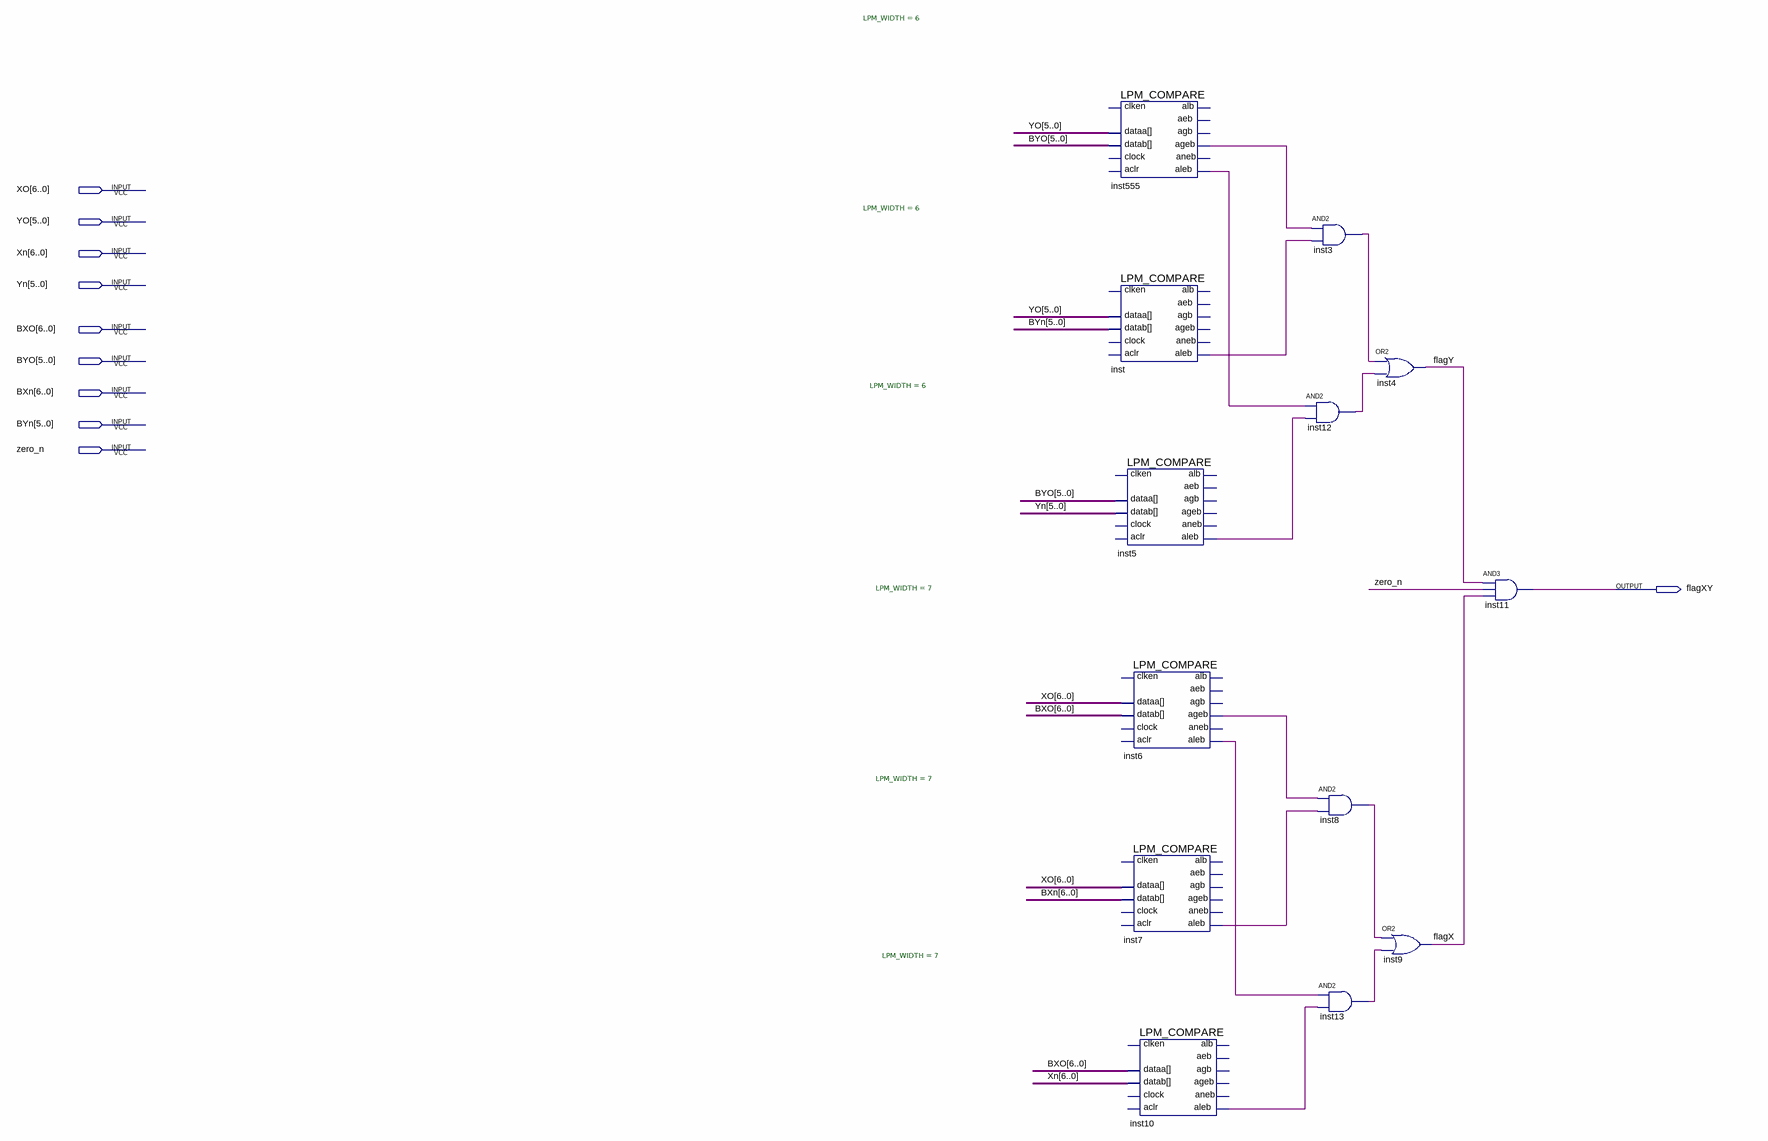
[diagram p0: schematic sheet]
// Quartus schematic HTPA_FIND_JUNCTION.bdf as structural Verilog: 13 symbols, 10 pins
module HTPA_FIND_JUNCTION (
  input  [6:0] XO,
  input  [5:0] YO,
  input  [6:0] Xn,
  input  [5:0] Yn,
  input  [6:0] BXO,
  input  [5:0] BYO,
  input  [6:0] BXn,
  input  [5:0] BYn,
  input  zero_n,
  output flagXY
);

  wire flagX, flagY, inst3_out, inst5_aleb, inst6_ageb, inst6_aleb, inst7_aleb, inst8_out, inst10_aleb,
       inst12_out, inst13_out, inst555_ageb, inst555_aleb, inst_aleb;

  LPM_COMPARE #(.LPM_WIDTH(6)) inst555 (
    .dataa(YO), .datab(BYO), .aleb(inst555_aleb), .ageb(inst555_ageb));  // open: clock, aclr, clken, aeb, agb, aneb, alb
  LPM_COMPARE #(.LPM_WIDTH(6)) inst (
    .dataa(YO), .datab(BYn), .aleb(inst_aleb));  // open: clock, aclr, clken, aeb, agb, aneb, ageb, alb
  LPM_COMPARE #(.LPM_WIDTH(6)) inst5 (
    .dataa(BYO), .datab(Yn), .aleb(inst5_aleb));  // open: clock, aclr, clken, aeb, agb, aneb, ageb, alb
  LPM_COMPARE #(.LPM_WIDTH(7)) inst6 (
    .dataa(XO), .datab(BXO), .aleb(inst6_aleb), .ageb(inst6_ageb));  // open: clock, aclr, clken, aeb, agb, aneb, alb
  LPM_COMPARE #(.LPM_WIDTH(7)) inst7 (
    .dataa(XO), .datab(BXn), .aleb(inst7_aleb));  // open: clock, aclr, clken, aeb, agb, aneb, ageb, alb
  LPM_COMPARE #(.LPM_WIDTH(7)) inst10 (
    .dataa(BXO), .datab(Xn), .aleb(inst10_aleb));  // open: clock, aclr, clken, aeb, agb, aneb, ageb, alb
  and inst3 (inst3_out, inst555_ageb, inst_aleb);
  and inst12 (inst12_out, inst555_aleb, inst5_aleb);
  and inst8 (inst8_out, inst6_ageb, inst7_aleb);
  and inst13 (inst13_out, inst6_aleb, inst10_aleb);
  or inst4 (flagY, inst3_out, inst12_out);
  or inst9 (flagX, inst8_out, inst13_out);
  and inst11 (flagXY, flagY, zero_n, flagX);
endmodule
